# EasyEDA schematic SCH_Water-Quality-monitoring_2025-07-13.json
TITLE: Sheet_1; REV: 1.0; Date: 2024-11-17; Sheet: 1/1; Drawn By: noumanmeer; Company: Your Company
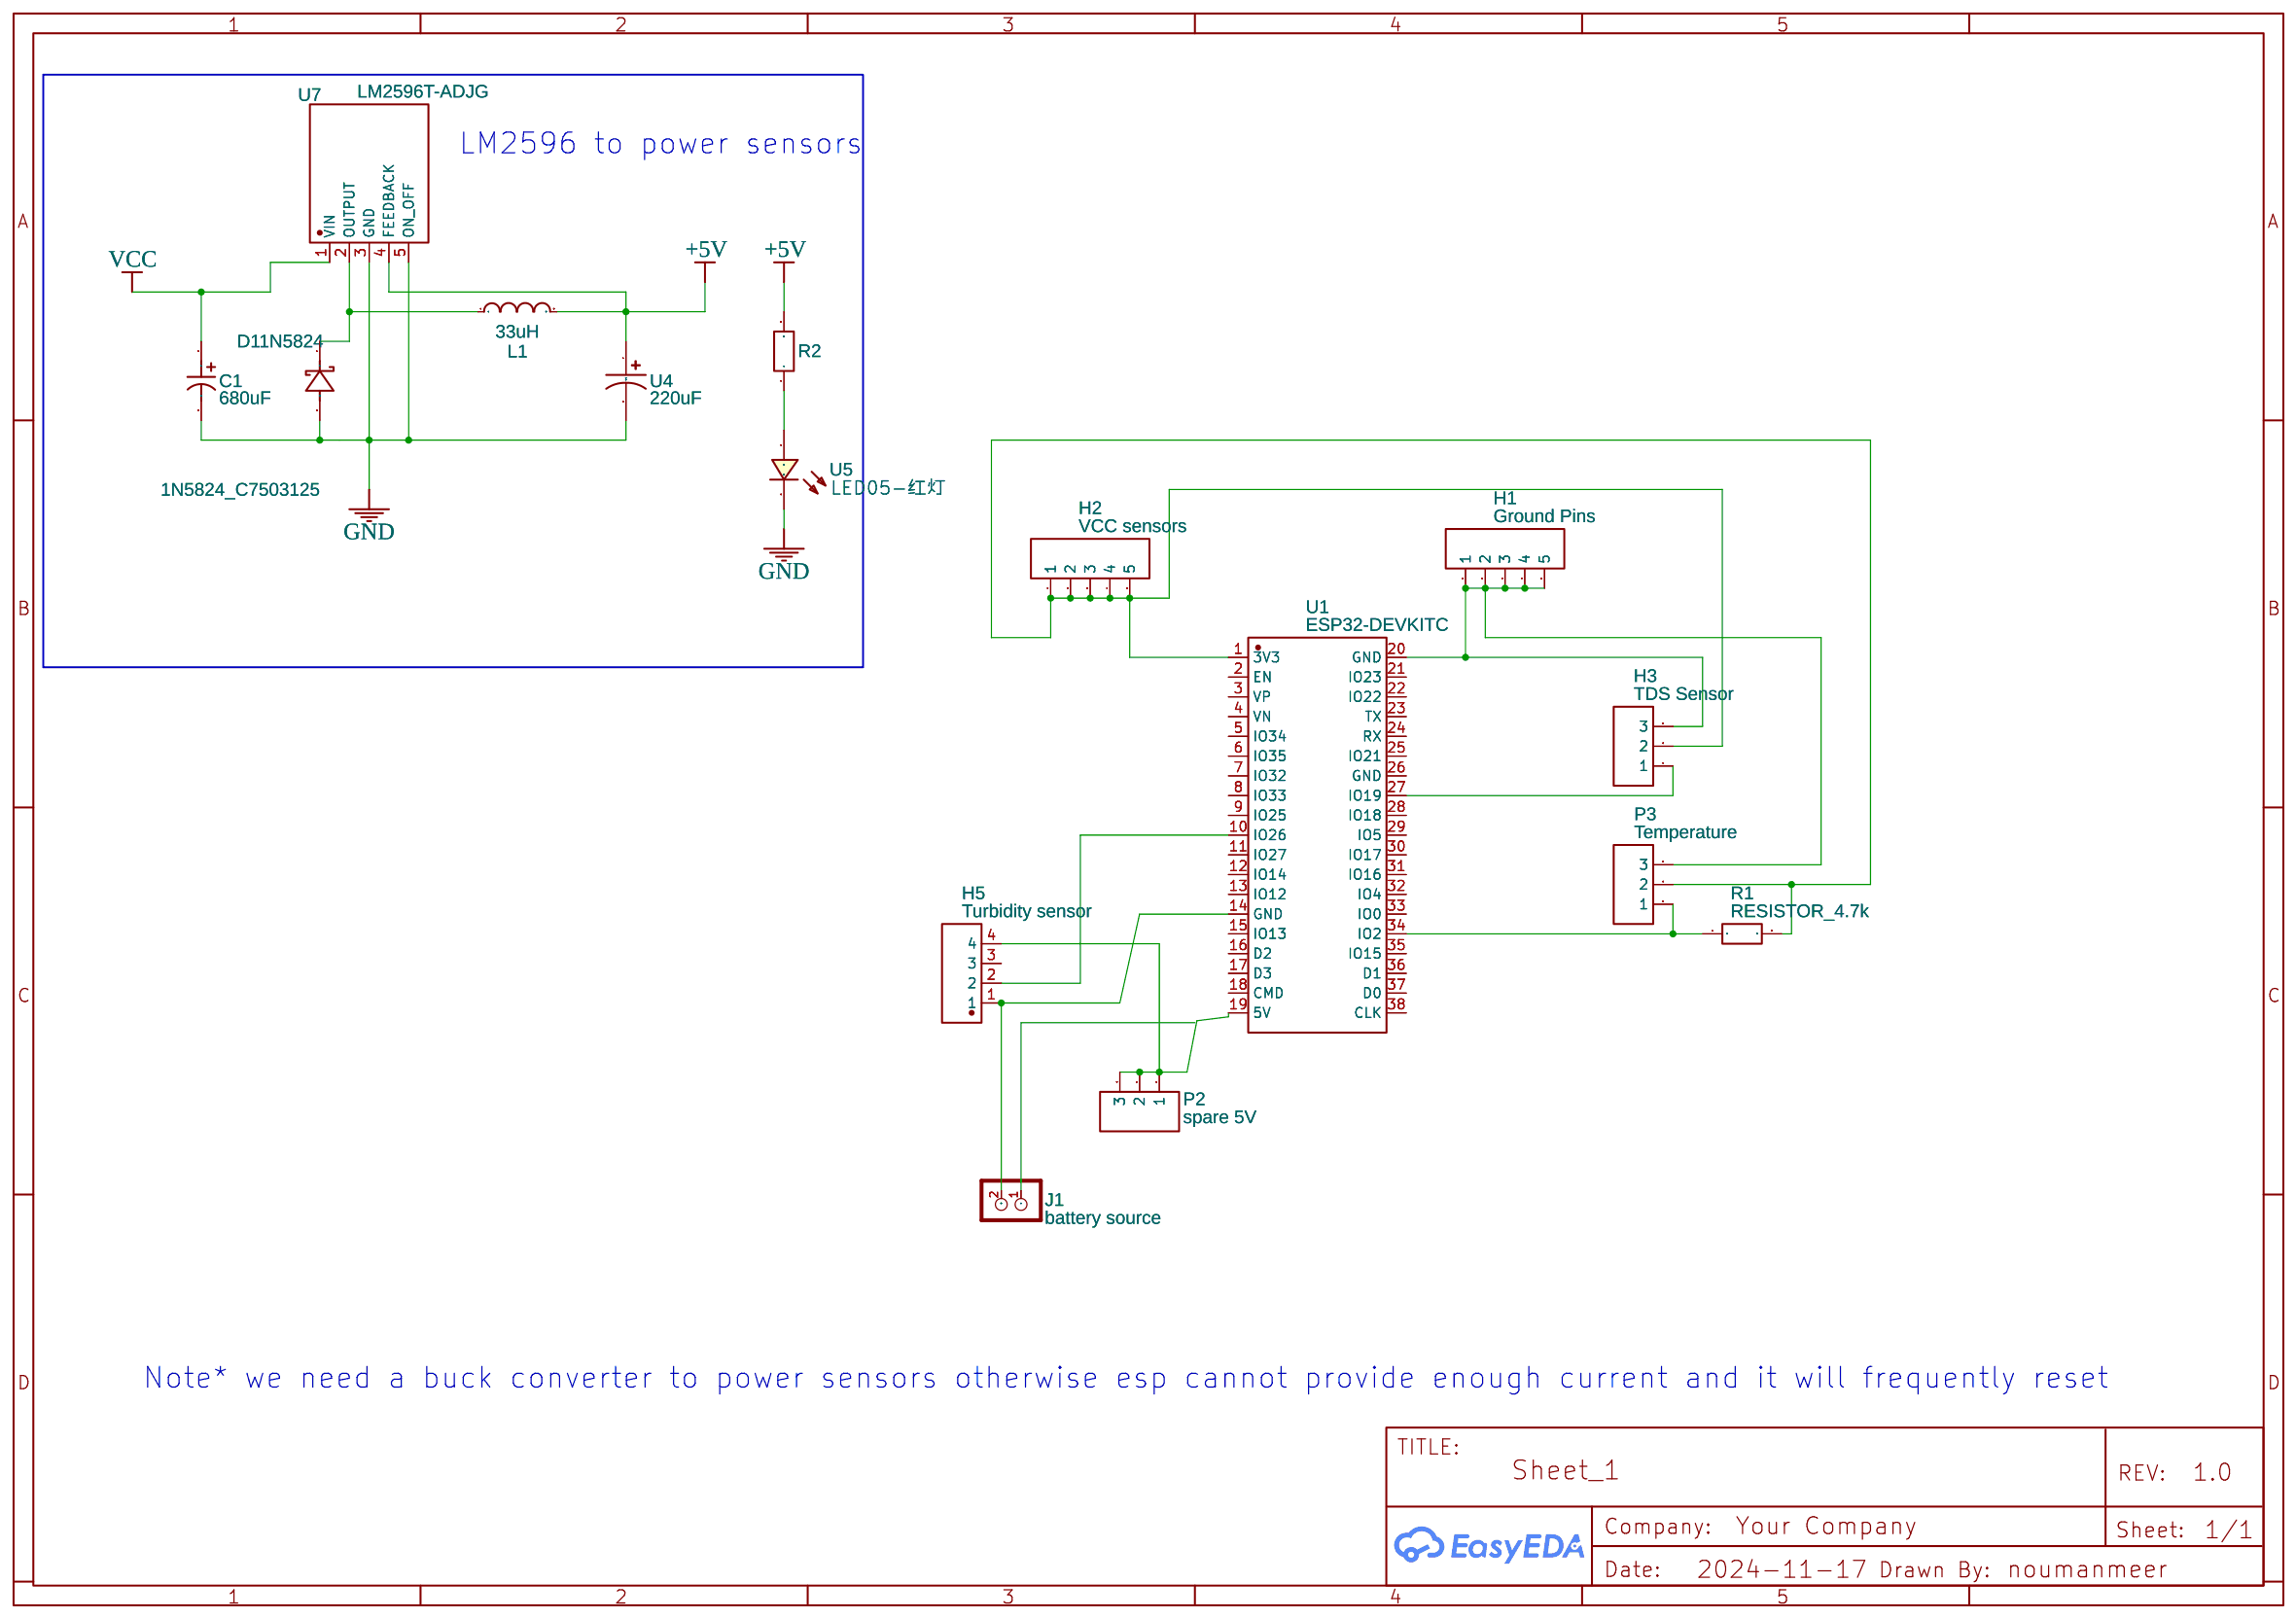
[diagram p0: schematic sheet]

## Parts
C1  680uF  [CAP-TH_BD10.0-P5.00-D1.0-FD]
D11N5824  1N5824_C7503125  [DO-27_BD5.3-L8.4-P12.40-D1.3-RD]
H1  Ground Pins  [HDR-TH_5P-P2.54-V-F]
H2  VCC sensors  [HDR-TH_5P-P2.54-V-F]
H3  TDS Sensor  [HDR-TH_3P-P2.54-V-M-1]
H5  Turbidity sensor  [HDR-TH_4P-P2.54-V-F]
J1  battery source  [TERMINAL_BLOCK_2P_5]
L1  33uH  [IND-SMD_L5.0-W5.0_FNR5012S]
P2  spare 5V  [HDR-TH_3P-P2.54-V-F]
P3  Temperature  [HDR-TH_3P-P2.54-V-F]
R1  RESISTOR_4.7k  [RES-TH_12R_2W]
R2  贴片电阻CHIPRESISTORS  [R0603]
U1  ESP32-DEVKITC  [BULETM-SMD_ESP32-DEVKITC]
U4  220uF  [CAP-TH_BD6.3-P2.50-D0.5-FD]
U5  LED05-红灯  [LED-TH_LED-3MM_RED]
U7  LM2596T-ADJG  [TO-220-5L_L10.2-W4.5-P1.71-L]

## Library data of the parts
C1 = 22UF400V87EC0285: Contributor: LCSC; Supplier: LCSC; Supplier Part: C2803204; Manufacturer: KNSCHA(科尼盛); JLCPCB Part Class: Extended Part
D11N5824 = 1N5824_C7503125: Supplier: LCSC; Supplier Part: C7503125; Manufacturer: FUXINSEMI(富芯森美); Manufacturer Part: 1N5824; JLCPCB Part Class: Extended Part; Contributor: lcsc
H1 H2 = Header-Female-2.54_1x5: Supplier: LCSC; Manufacturer: BOOMELE(博穆精密); Manufacturer Part: 2.54-1*5P母; Supplier Part: C50950; JLCPCB Part Class: Extended Part
H3 = Header-Male-2.54_1x3: Supplier: LCSC; Manufacturer: BOOMELE(博穆精密); Manufacturer Part: 2.54-1*3P针; Supplier Part: C49257; JLCPCB Part Class: Extended Part
H5 = PM2.54-1*4: Contributor: lcsc; Supplier: LCSC; Supplier Part: C5116530; Manufacturer: ZHOURI(洲日); JLCPCB Part Class: Extended Part
J1 = CON_TERMINAL_BLOCK_02-5MM: 2 poles wire to board terminal block; Contributor: DangerousPrototype
L1 = CKCS5040-33UH/M: Contributor: LCSC; Supplier: LCSC; Supplier Part: C354612; Manufacturer: CENKER(岑科); Manufacturer Part: CKCS5040-33uH/M; JLCPCB Part Class: Extended Part
P2 P3 = Header-Female-2.54_1x3: Supplier Part: C146243; Supplier: LCSC; Manufacturer: BOOMELE(博穆精密); Manufacturer Part: 2.54-1*3P母; JLCPCB Part Class: Extended Part
R1 = RESISTOR_THT:R_AXIAL_DIN0309_L9.0MM_D3.2MM_P2.54MM_VERTICAL: Contributor: lcsc; Supplier: LCSC; Supplier Part: C9900016274; Manufacturer: null; Manufacturer Part: Resistor_THT:R_Axial_DIN0309_L9.0mm_D3.2mm_P2.54mm_Vertical; JLCPCB Part Class: Extended Part
R2 = 贴片电阻CHIPRESISTORS: Contributor: lcsc; Supplier: LCSC; Supplier Part: C9900014833; Manufacturer: null; Manufacturer Part: 贴片电阻ChipResistors; JLCPCB Part Class: Extended Part
U1 = ESP32-DEVKITC: Supplier: LCSC; Supplier Part: C571180; Manufacturer: ESPRESSIF(乐鑫); Manufacturer Part: ESP32-DevKitC; Contributor: lcsc; JLCPCB Part Class: Extended Part
U4 = 16YK220M6.3X11: Contributor: lcsc; Supplier: LCSC; Supplier Part: C5114479; Manufacturer: rubycon(红宝石)
U5 = LED05-红灯: Contributor: LCSC; Supplier: LCSC; Supplier Part: C9900009041; Manufacturer: null; JLCPCB Part Class: Extended Part
U7 = LM2596T-ADJG: Supplier: LCSC; Supplier Part: C2977087; Manufacturer: HGC(深圳汉芯); JLCPCB Part Class: Extended Part; Contributor: lcsc

## Nets
+5V: L1.2 R2.2 U4.1 U7.4(FEEDBACK)
GND: C1.2 D11N5824.2(A) U4.2 U5.2 U7.3(GND) U7.5(ON_OFF)
VCC: C1.1 U7.1(VIN)
Net-(D11N5824-1): D11N5824.1(K) L1.1 U7.2(OUTPUT)
Net-(H1-1): H1.1 H1.2 H1.3 H1.4 H1.5 H3.3 P3.3 U1.20(GND)
Net-(H2-1): H2.1 H2.2 H2.3 H2.4 H2.5 H3.2 P3.2 R1.2 U1.1(3V3)
Net-(H3-1): H3.1 U1.27(IO19)
Net-(H5-1): H5.1 J1.2 U1.14(GND)
Net-(H5-2): H5.2 U1.10(IO26)
Net-(H5-4): H5.4 P2.1 P2.2 P2.3 U1.19(5V)
Net-(P3-1): P3.1 R1.1 U1.34(IO2)
Net-(R2-1): R2.1 U5.1

Not connected (* = marked no-connect by the designer): H5 3; J1 1; U1 2(EN) 3(VP) 4(VN) 5(IO34) 6(IO35) 7(IO32) 8(IO33) 9(IO25) 11(IO27) 12(IO14) 13(IO12) 15(IO13) 16(D2) 17(D3) 18(CMD) 21(IO23) 22(IO22) 23(TX) 24(RX) 25(IO21) 26(GND) 28(IO18) 29(IO5) 30(IO17) 31(IO16) 32(IO4) 33(IO0) 35(IO15) 36(D1) 37(D0) 38(CLK)

## Notes on the sheet
- LM2596 to power sensors
- Note* we need a buck converter to power sensors otherwise esp cannot provide enough current and it will frequently reset
